# EAGLE design Logic DC Jack v1.0 (EAGLE 7.1.0)
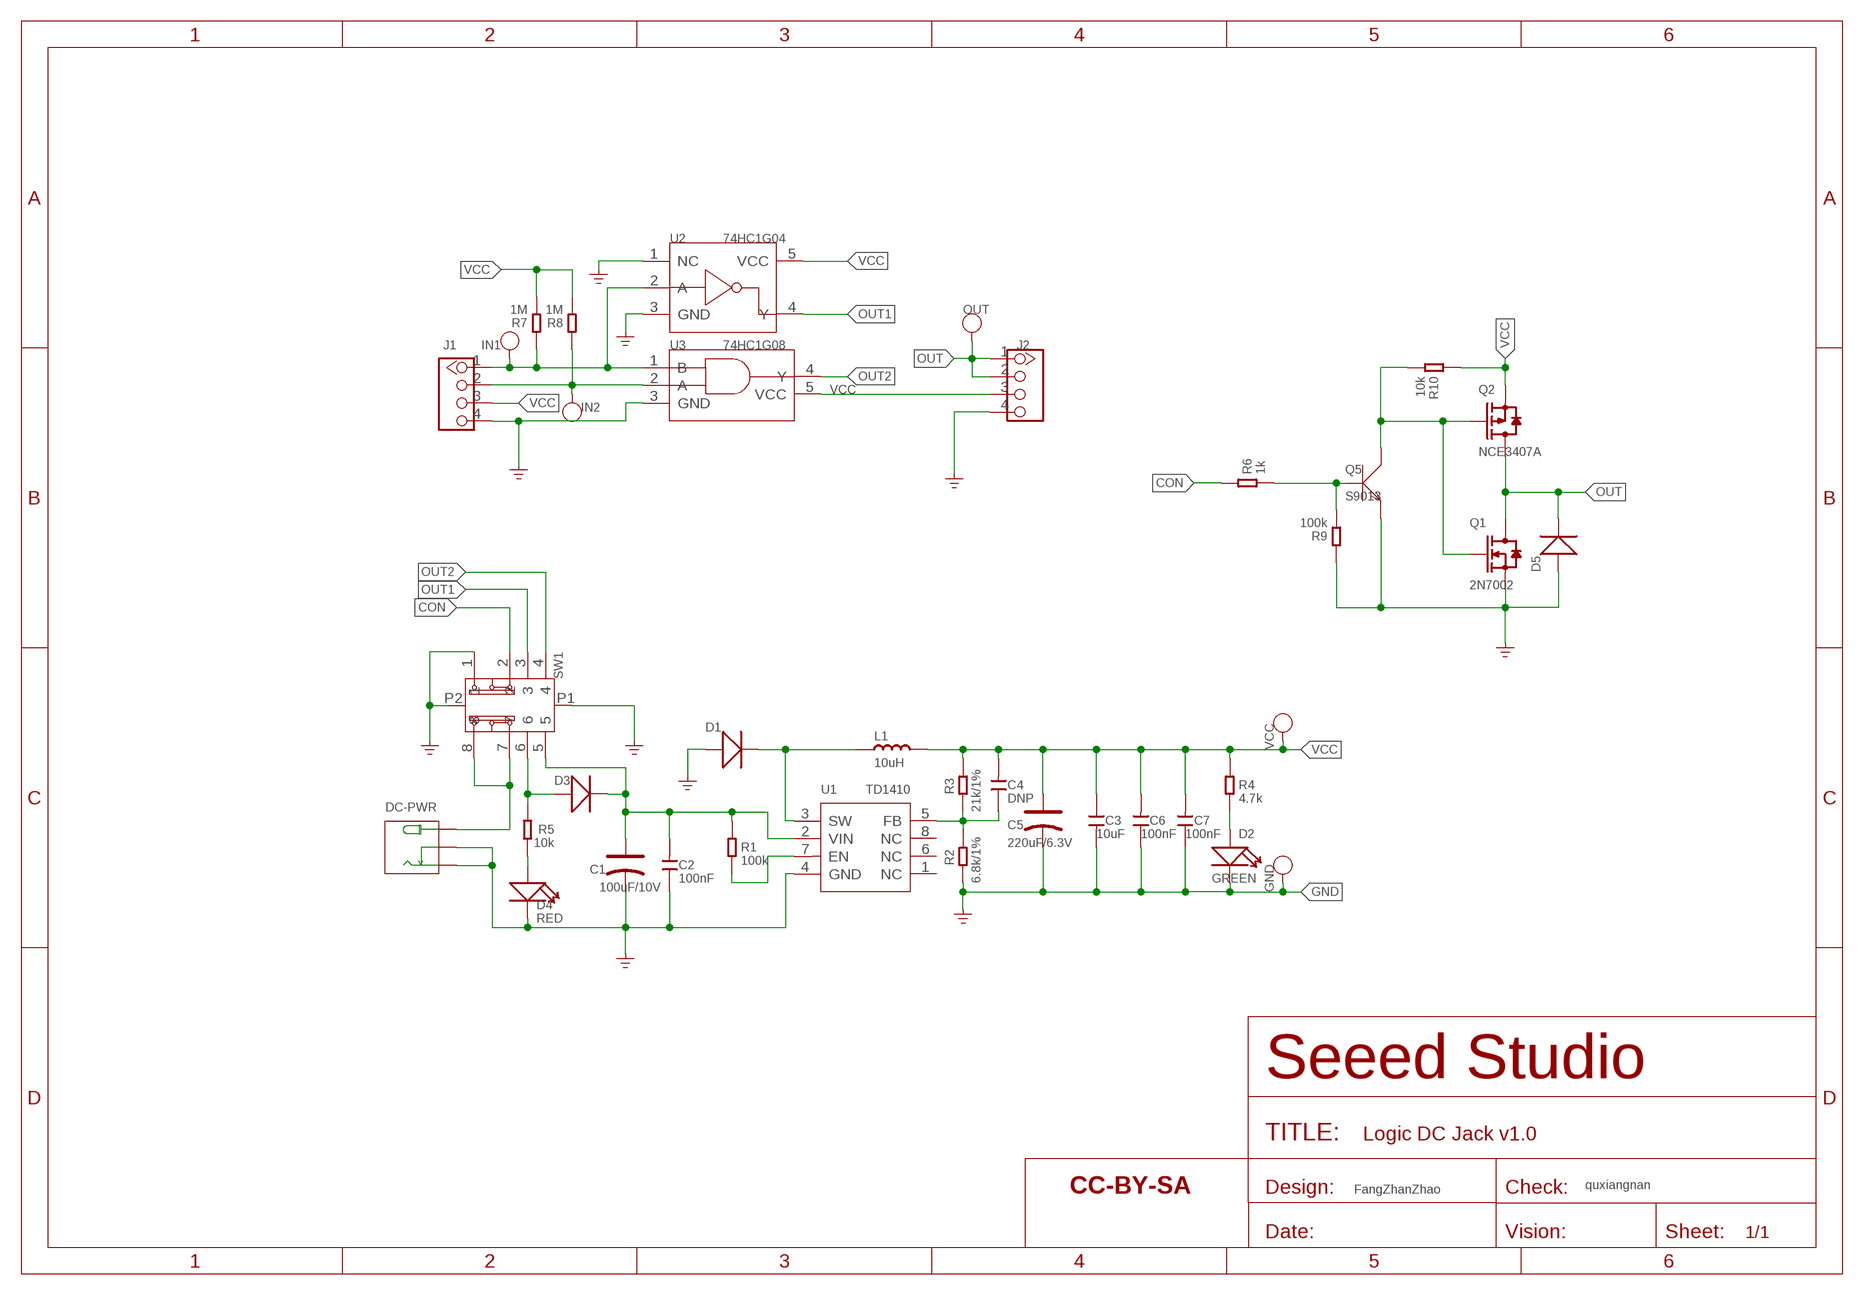
[diagram p0: schematic, sheet 1]

## Parts
C1  100uF/10V  CAP-POLAR-AVX-B  [AVX-B]
C2  100nF  CAP-0603  [C0603]
C3  10uF  CAP-0805  [C0805]
C4  DNP  CAP-0603  [C0603]
C5  220uF/6.3V  CAP-POLAR-AVX-B  [AVX-B]
C6  100nF  CAP-0603  [C0603]
C7  100nF  CAP-0603  [C0603]
D1  DIODE'SMA'  [DO-214AC]
D2  GREEN  LED'0603'  [LED-0603]
D3  304020009  DIODE'SMA'  [DO-214AC]
D4  RED  LED'0603'  [LED-0603]
D5  DIODE'1206'  [SOD-123]
DC-PWR  320120002  POWER-JACK-DC'DC-044'  [3P-L11.6*W9.6*H7.0MM]
GND  PAD-TEST-POINT'4545'  [TP-D45MIL]
IN1  PAD-TEST-POINT'4545'  [TP-D45MIL]
IN2  PAD-TEST-POINT'4545'  [TP-D45MIL]
J1  GROVE-CONNECTOR-DIP-2.0  [4P-2.0]
J2  GROVE-CONNECTOR-DIP-2.0  [4P-2.0]
L1  10uH  INDUCTOR/FERRITE-BEAD'0630'  [L0630]
OUT  PAD-TEST-POINT'4545'  [TP-D45MIL]
Q1  2N7002  MOSFET-N'SOT23'  [SOT-23]
Q2  NCE3407A  MOSFET-P'SI2323CDS/SI2305DS<BR>'  [SOT-23]
Q5  S9013  TRANSISTOR-NPN-SOT23  [SOT-23]
R1  100k  RES-0603  [R0603]
R2  6.8k/1%  RES-0603  [R0603]
R3  21k/1%  RES-0603  [R0603]
R4  4.7k  RES-0603  [R0603]
R5  10k  RES-0603  [R0603]
R6  1k  RES-0603  [R0603]
R7  1M  RES-0603  [R0603]
R8  1M  RES-0603  [R0603]
R9  100k  RES-0603  [R0603]
R10  10k  RES-0603  [R0603]
SW1  SWITCH-SK-23D07SK-22D03H-G4  [8P-3CH-L16*W6.5*H7.5MM-90D]
U1  TD1410  PMIC-TD1410  [SOP-8]
U2  74HC1G04  74HC1G04'GW'  [SOT-353]
U3  74HC1G08  74HC1G08'GW'  [SOT-353]
U$12  SEEEDSTUDIO-OPEN-SCH-FRAME  [SEEEDSTUDIO-PCB-FRAME]
VCC  PAD-TEST-POINT'4545'  [TP-D45MIL]

## Nets
CON: R6.2 SW1.2
GND: C1.- C2.1 C3.2 C5.- C6.1 C7.1 D1.1(+) D2.- D4.- D5.+ DC-PWR.- DC-PWR.CDN GND.T J1.4 J2.4 Q1.2(S) Q5.2(E) R2.1 R9.2 SW1.1 SW1.P1 SW1.P2 U1.4(GND) U2.1(NC) U2.3(GND) U3.3(GND)
N$1: D4.+ R5.1
N$2: C4.1 R2.2 R3.2 U1.5(FB)
N$3: D2.+ R4.1
N$4: D3.1(+) R5.2 SW1.6
N$5: IN1.T J1.1 R7.2 U2.2(A) U3.1(B)
N$6: IN2.T J1.2 R8.2 U3.2(A)
N$7: D1.2(-) L1.1 U1.3(SW)
N$8: DC-PWR.+ SW1.7 SW1.8
N$9: R1.1 U1.7(EN)
N$11: Q5.1(B) R6.1 R9.1
N$12: C1.+ C2.2 D3.2(-) R1.2 SW1.5 U1.2(VIN)
N$13: Q1.1(G) Q2.1(G) Q5.3(C) R10.1
OUT: D5.- J2.1 J2.2 OUT.T Q1.3(D) Q2.3(D)
OUT1: SW1.3 U2.4(Y)
OUT2: SW1.4 U3.4(Y)
VCC: C3.1 C4.2 C5.+ C6.2 C7.2 J1.3 J2.3 L1.2 Q2.2(S) R3.1 R4.2 R7.1 R8.1 R10.2 U2.5(VCC) U3.5(VCC) VCC.T
Unconnected: U1.1(NC) U1.6(NC) U1.8(NC)

## Notes on the sheet
- quxiangnan
- FangZhanZhao

## Library data of the parts
C1 C5 = Discrete-new:CAP-POLAR: Electrolytic Capacitors,Tantalum Capacitors and Super Capacitors
C2-C4 C6 C7 = Discrete-new:CAP: Ceramic Capacitors
D1 D3 D5 = Discrete-new:DIODE*
D2 D4 = Discrete-new:LED
DC-PWR = Connector-new:POWER-JACK-DC: 3P-L11.6*W9.6*H7.0MM:320120002;3P-L14.2*W11.0*H9.0MM:320120003
GND IN1 IN2 OUT VCC = Discrete-new:PAD-TEST-POINT; PARTNO: DNP
J1 J2 = Connector-new:GROVE-CONNECTOR-DIP: 4P-2.0:320110033;4P-2.0-90D:320110034
L1 = Discrete-new:INDUCTOR/FERRITE-BEAD
Q1 = Discrete-new:MOSFET-N: IRLL014: http://www.vishay.com/docs/91319/sihll014.pdf
Q2 = Discrete-new:MOSFET-P
Q5 = Discrete-new:TRANSISTOR-NPN*: NPN audion
R1-R10 = Discrete-new:RES
SW1 = template:SWITCH-SK-23D07
U1 = IC-new:PMIC-TD1410: 310030105
U2 = template:74HC1G04: 74HC1G04 and 74HCT1G04 are high-speed Si-gate CMOS devices. They provide an inverting buffer.
U3 = template:74HC1G08: 2-input AND gate
U$12 = moudle-new:SEEEDSTUDIO-OPEN-SCH-FRAME

## Net classes
0 default: width 0.102 mm, drill 0.203 mm, clearance 0.102 mm
3 usbvcc: width 0.203 mm, drill 0.305 mm, clearance 0.203 mm

## Board
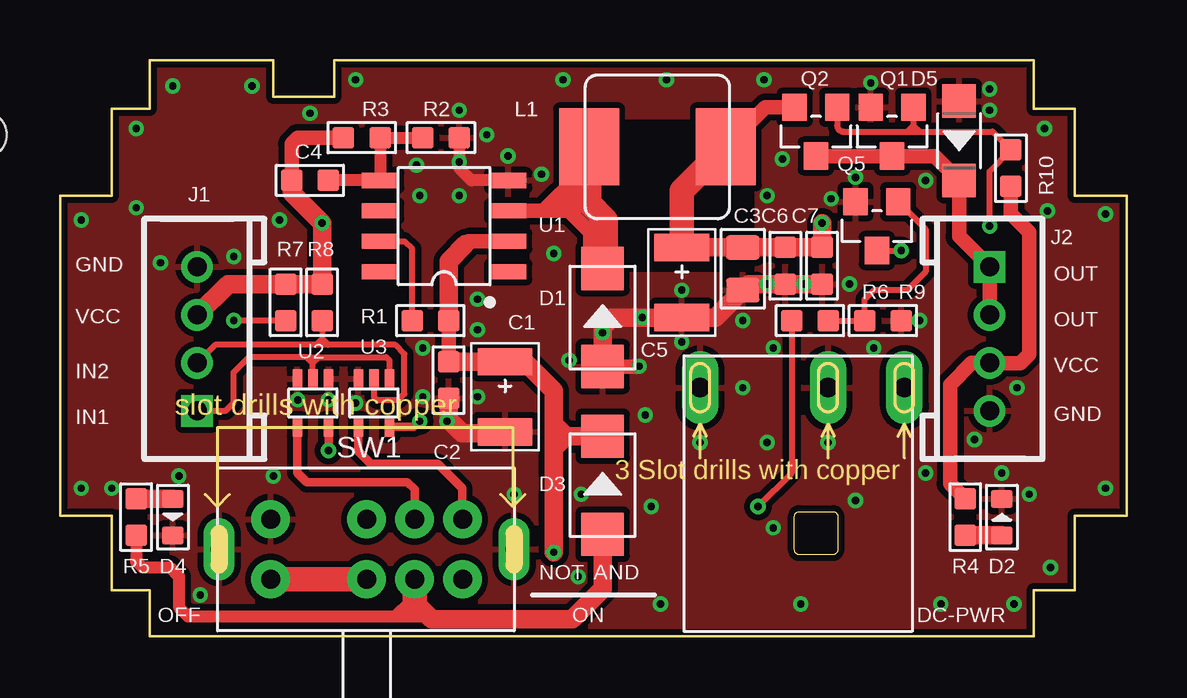
[diagram p1: board, top side]
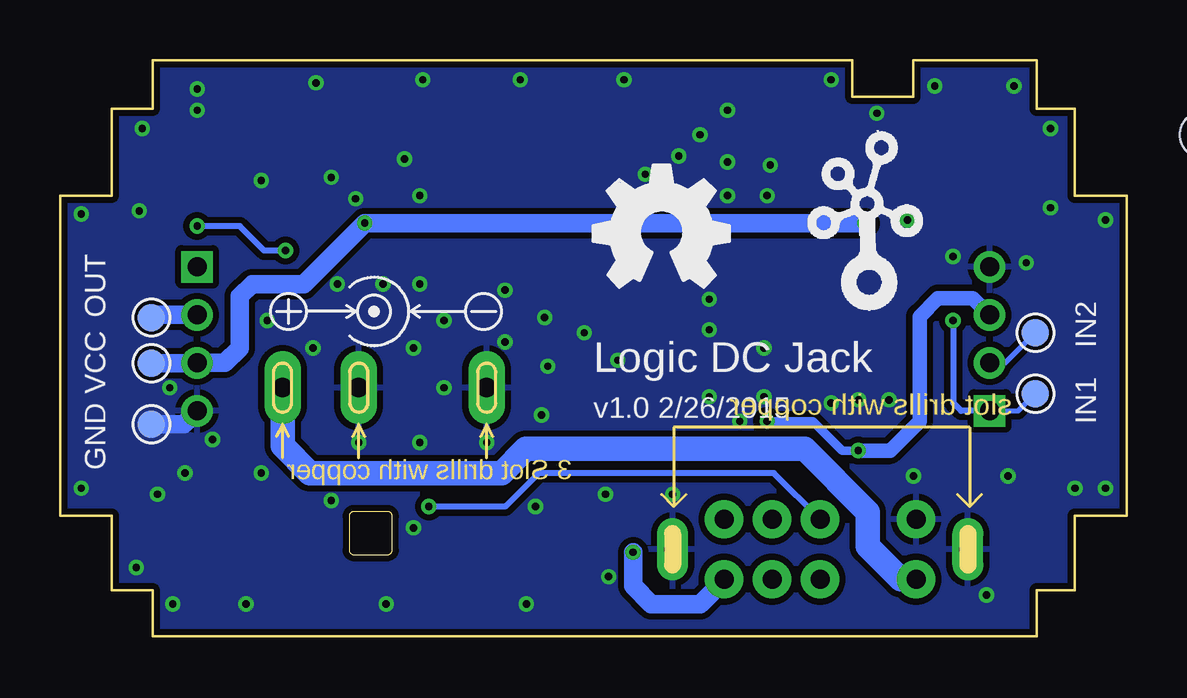
[diagram p2: board, bottom side, seen from below]

Size 44.45 x 24 mm. Coordinates in mm from the lower left corner, seen from the top.
Outline: 3.75,1.9 3.75,0 40.58,0 40.58,1.9 42.29,1.9 42.29,5.02 44.45,5.02 44.45,18.35 42.29,18.35 42.29,21.97 40.58,21.97 40.58,24 11.43,24 11.43,22.48 8.89,22.48 8.89,24 3.75,24 3.75,21.97 2.16,21.97 2.16,18.35 0,18.35 0,5.02 2.16,5.02 2.16,1.9 3.75,1.9
Copper layers (1*16): Top 0.035mm / dielectric 1.5mm / Bottom 0.035mm
Design rules "SeeedStudio_2layer_DRU_no_angle_20140221 *": minimum track width 4mil, minimum drill 10mil, track to track 8mil, track to pad 8mil, pad to pad 8mil, via to via 6mil, smd to smd 0mil, copper to edge 10mil, drill to drill 10mil, minimum pad ring 10mil, minimum via ring 6mil, stop-mask expansion 2mil, vias tented up to drill 25mil, thermal gap 10mil
Holes 1.91 mm at -3.17,20.89 136.53,20.89 -3.17,-139.13 136.53,-139.13
tRestrict: area 22.9,15.4 to 28.7,21.3

### Footprints (pad centres in the part's own frame; a part is rotated, then mirrored left to right if it is on the bottom)
AVX-B = smd 1.143 x 2.286: + -1.46,0; - 1.46,0
C0603 = smd 0.889 x 0.889: 1 -0.762,0; 2 0.762,0
C0805 = smd 1.016 x 1.397: 1 -0.889,0; 2 0.889,0
DO-214AC = smd 1.8 x 1.77: 1 -2.042,0; 2 2.042,0
LED-0603 = smd 0.762 x 0.889: + -0.762,0; - 0.762,0
SOD-123 = smd 1.397 x 1.397: + -1.651,0; - 1.651,0
3P-L11.6*W9.6*H7.0MM = drill 0.813 pad 1.524 long: + 4.381,10.16; - -4.128,10.16; CDN 1.206,10.16
TP-D45MIL = smd 1.143 x 1.143: T 0,0
4P-2.0 = drill 0.8 pad 1.27 square: 1 -3,0 | drill 0.8 pad 1.27: 2 -1,0; 3 1,0; 4 3,0
L0630 = smd 2.5 x 3.2: 1 -2.85,0; 2 2.85,0
SOT-23 = smd 1.016 x 1.143: 1 -0.889,-1.016; 2 0.889,-1.016; 3 0,1.016
R0603 = smd 0.889 x 0.889: 1 -0.762,0; 2 0.762,0
8P-3CH-L16*W6.5*H7.5MM-90D = drill 0.8 pad 1.6: 1 -4,1.25; 2 0,1.25; 3 2,1.25; 4 4,1.25; 5 4,-1.25; 6 2,-1.25; 7 0,-1.25; 8 -4,-1.25 | drill 0.7 pad 1.3 long: P1 -6.15,0; P2 6.15,0
SOP-8 = smd 0.635 x 1.524: 1 -1.905,-2.667; 2 -0.635,-2.667; 3 0.635,-2.667; 4 1.905,-2.667; 5 1.905,2.667; 6 0.635,2.667; 7 -0.635,2.667; 8 -1.905,2.667
SOT-353 = smd 0.4 x 0.8: 1 -0.65,-1; 2 0,-1; 3 0.65,-1; 4 0.65,1; 5 -0.65,1

### Placement (x,y rotation side)
C1  18.54,9.97 270 top
C2  16.19,10.67 90 top
C3  28.45,15.3 270 top
C4  10.41,18.99 180 top
C5  25.91,14.73 270 top
C6  30.23,15.43 90 top
C7  31.75,15.43 90 top
D1  22.61,13.27 90 top
D2  39.24,4.95 90 top
D3  22.61,6.29 90 top
D4  4.7,4.95 270 top
D5  37.47,20.64 270 top
DC-PWR  30.8,0.19 0 top
GND  40.64,8.83 0 bottom
IN1  3.81,10.1 0 bottom
IN2  3.81,12.64 0 bottom
J1  5.71,12.38 90 top
J2  38.73,12.38 270 top
L1  24.89,20.38 0 top
OUT  40.64,13.27 0 bottom
Q1  34.67,21.02 180 top
Q2  31.5,21.02 180 top
Q5  34.04,17.08 180 top
R1  15.43,13.14 0 top
R2  15.88,20.76 180 top
R3  12.57,20.76 0 top
R4  37.72,4.95 90 top
R5  3.18,4.95 270 top
R6  31.24,13.14 180 top
R7  9.4,13.91 270 top
R8  10.92,13.91 270 top
R9  34.29,13.14 0 top
R10  39.62,19.49 270 top
SW1  12.78,3.62 0 top
U1  16,17.08 90 top
U2  10.54,9.72 180 top
U3  13.08,9.72 180 top
U$1  [OSHW_FILLX200_NOTEXT]  22.23,14.54 0 bottom
U$11  [GROVE-SILK-BIG]  10.8,14.54 0 bottom
U$12  -10.29,-10.86 0 top  (outside the outline)
VCC  40.64,11.37 0 bottom

### Tracks (layer width: path | path; a pad name or v marks a point on that pad's centre or on a via)
CON  (via drill 0.3 pad 0.64)
  Top 0.254: R6.2 30.48,6.79 v29.08,5.4
  Bottom 0.254: v29.08,5.4 25.91,5.4 24.51,6.79 14.7,6.79 SW1.2
GND  (via drill 0.3 pad 0.64)
  Top 0.508: R2.1 16.64,19.49 17.15,18.99 U1.4
  Top 0.61: D1.1 24.12,11.23 v24.13,11.24
  Top 0.762: C2.1 16.19,9.02 16.76,8.45 18.48,8.45 C1.- | C7.1 C6.1 28.7,14.67 C3.2 27.3,13.27 C5.- 22.99,13.27 22.61,12.89 D1.1
  Bottom 0.762: GND.T 39.29,8.83 J2.4
  other vias: 28.45,13.14 24.26,13.27 22.61,12.64 21.21,11.49 32.89,14.67 29.46,14.67 30.99,14.67 33.91,12 35.81,13.14 32.13,18.22 33.78,23.05 38.73,21.91 38.73,22.8 18.67,20 16.64,21.91 17.78,20.89 16.64,19.75 9.91,9.84 12.32,9.72 11.18,9.84 33.15,19.11 40.39,5.91 39.24,6.79 4.7,22.92 8,22.92 12.32,23.18 20.96,23.18 29.34,23.18 41.02,21.15 43.56,17.59 43.56,6.16 41.28,2.86 39.75,1.33 25.02,1.33 30.86,1.33 36.7,1.33 21.72,5.91 24.64,5.4 26.67,8.06 3.18,21.15 3.18,17.84 0.89,17.34 0.89,6.16 2.16,6.16 5.84,1.71 4.95,6.67 4.19,15.56 9.14,17.34 10.41,21.78 25.27,23.18 30.1,19.88 29.46,18.35 20.07,19.24 20.57,15.94 25.91,14.41 25.91,12.26 28.45,10.35 32,8.06 21.59,2.48 36.07,6.79 36.07,18.99 8.89,6.67 29.72,4.51 29.46,8.06 29.72,12 33.15,5.65 38.1,8.19 39.88,10.35 41.15,17.72 7.24,15.81 14.86,19.62 14.99,18.35 16.64,18.35 17.4,14.03 17.4,12.76 16.13,8.95 17.4,9.97 15.11,9.97 15.11,12 18.92,5.91 24.38,9.21
  pour Top (isolate 0.254): -3.68,27.37 46.48,27.37 46.48,-5.02 -3.68,-5.02
  pour Bottom (isolate 0.254): -3.68,27.75 46.48,27.75 46.48,-4.64 -3.68,-4.64
N$1
  Top 0.762: R5.1 D4.+
N$2
  Top 0.508: R2.2 R3.2 U1.5 C4.1
N$3
  Top 0.762: R4.1 D2.+
N$4
  Top 0.508: R5.2 3.18,3.11 3.43,2.86 4.57,2.86 4.95,2.48 4.95,1.21 5.33,0.83 13.97,0.83 | 13.97,0.83 14.19,0.83 | 14.19,0.83 14.38,1.02 | 14.38,1.02 14.78,1.42 | 14.38,1.02 15.17,1.02 15.24,0.95 | 14.19,0.83 15.37,0.83 15.49,0.7 | 13.97,0.83 14.61,1.46
  Top 0.762: 14.78,1.42 15.24,0.95 15.49,0.7 21.34,0.7 22.61,1.97 D3.1
  Top 1.016: 14.78,1.42 SW1.6
N$5  (via drill 0.3 pad 0.64)
  Top 0.254: R7.2 v7.24,13.14 | U2.2 10.54,11.37 | 10.54,11.37 10.29,11.62 | 10.29,11.62 10.8,11.62 | 10.54,11.37 10.8,11.62 | 10.8,11.62 13.59,11.62 13.73,11.48 U3.1 | 10.29,11.62 7.87,11.62 7.24,10.99 7.24,9.72 6.91,9.38 J1.1
  Bottom 0.203: J1.1 4.52,9.38 IN1.T
  Bottom 0.254: v7.24,13.14 7.24,9.72 6.91,9.38 J1.1
N$6
  Top 0.254: R8.2 10.92,12.38 | 10.92,12.38 10.67,12.13 | U3.2 13.08,9.97 13.21,9.84 14.1,9.84 14.35,10.1 14.35,11.75 13.97,12.13 11.18,12.13 | 11.18,12.13 10.67,12.13 | 10.92,12.38 11.18,12.13 | 10.67,12.13 6.46,12.13 J1.2
  Bottom 0.203: J1.2 5.06,11.38 IN2.T
N$7
  Top 0.61: 21.46,19.04 20.26,17.84 21.08,17.84 22.1,16.83 22.1,15.05 22.23,14.92 | 21.46,19.04 21.56,19.14 | 21.56,19.14 22.04,19.62 | 21.46,19.04 21.46,18.1 | 21.46,18.1 21.46,17.84 21.08,18.22 21.08,18.61 21.59,19.11 21.57,19.14 21.56,19.14 | U1.3 21.08,17.72 21.46,18.1
  Top 1.016: L1.1 22.04,19.62 22.04,18.03 22.73,17.34 22.73,15.44 D1.2
N$8
  Top 1.016: SW1.7 SW1.8
  Bottom 1.016: SW1.8 9.42,2.37 10.8,3.75 10.8,5.17 13.42,7.8 | DC-PWR.+ 35.18,7.94 34.04,6.79 26.04,6.79 25.03,7.8 13.42,7.8 | 13.42,7.8
N$9
  Top 0.254: U1.7 14.35,16.45 14.67,16.13 R1.1
N$11
  Top 0.254: R6.1 R9.1 33.53,14.03 33.91,14.41 35.31,14.41 36.07,15.18 36.07,16.95 Q5.1
N$12  (via drill 0.3 pad 0.64)
  Top 0.61: C2.2 R1.2 | 16.32,15.75 16.89,16.32 17.02,16.45 U1.2
  Top 0.762: 19.11,11.43 C1.+ C2.2 | 19.11,11.43 19.18,11.49 | 19.11,11.43 19.37,11.43 20.57,10.22 20.57,8.83 | 20.57,8.83 21.08,8.32 | 21.08,8.32 22.6,8.32 D3.2 | R1.2 16.19,15.62 16.89,16.32 | 20.57,8.83 v20.57,3.49 | 21.08,8.32 20.7,7.94
  Bottom 0.762: 16.78,2.34 17.78,1.33 19.81,1.33 20.57,2.1 v20.57,3.49
  Bottom 1.016: 16.78,2.34 SW1.5
N$13  (via drill 0.3 pad 0.64)
  Top 0.254: Q5.3 v35.05,16.07 | v38.73,17.08 38.73,19.37 R10.1 38.86,21.02 35.81,21.02 | Q2.1 32.39,21.27 arc90 32.64,21.02 35.31,21.02 | 35.31,21.02 35.56,21.02 | 35.56,21.02 35.81,21.02 | Q1.1 35.56,21.27 | 35.56,21.27 35.56,21.02 | 35.56,21.27 35.31,21.02 | 35.56,21.27 35.81,21.02
  Bottom 0.254: v35.05,16.07 35.94,16.07 36.96,17.08 v38.73,17.08
OUT
  Top 0.61: Q2.3 Q1.3 36.45,20 D5.- 37.47,16.65 J2.1 J2.2
  Bottom 0.762: J2.2 40.53,13.38 OUT.T
OUT1
  Top 0.356: U2.4 9.89,6.81 10.29,6.41 14.48,6.41 14.78,6.12 SW1.3
OUT2
  Top 0.356: U3.4 12.43,7.7 12.95,7.18 15.75,7.18 16.76,6.16 16.76,4.88 SW1.4
VCC  (via drill 0.3 pad 0.64)
  Top 0.356: U2.5 v11.19,7.73 | U3.5 14.75,8.72 v14.99,8.95
  Top 0.61: R10.2 39.62,17.59 40.39,16.83 40.39,11.75 40.01,11.37 38.75,11.37 J2.3 37.99,11.38 37.08,10.48 37.08,6.35 R4.2 | Q2.2 29.39,22.03 L1.2 | R3.1 9.91,20.76 9.65,20.51 C4.2
  Top 0.762: C5.+ C3.1 C6.2 C7.2 v31.75,17.21 | C4.2 9.65,18.48 v10.92,17.21 R8.1 R7.1 7,14.67 J1.3
  Top 1.016: C5.+ 25.91,18.55 L1.2
  Bottom 0.356: v14.99,8.95 13.08,8.95 11.86,7.73 v11.19,7.73
  Bottom 0.61: v11.19,7.73 9.86,7.73 8.64,8.96 8.64,13.31 7.87,14.08 | J1.3 6.41,14.08 7.87,14.08 | 7.87,14.08
  Bottom 0.762: v10.92,17.21 v31.75,17.21 34.29,14.67 36.45,14.67 36.96,14.16 36.96,12 37.58,11.38 J2.3 38.75,11.37 VCC.T

### Text on the board
tPlace: GND | OUT | VCC | OUT | IN2 | VCC | IN1 | GND | NOT | AND | OFF | ON
bPlace: Logic DC Jack | v1.0 2/26/2015